# Altium schematic sheet 0_Overview.SchDoc
size A4; SheetNumber: 1; SheetTotal: 5
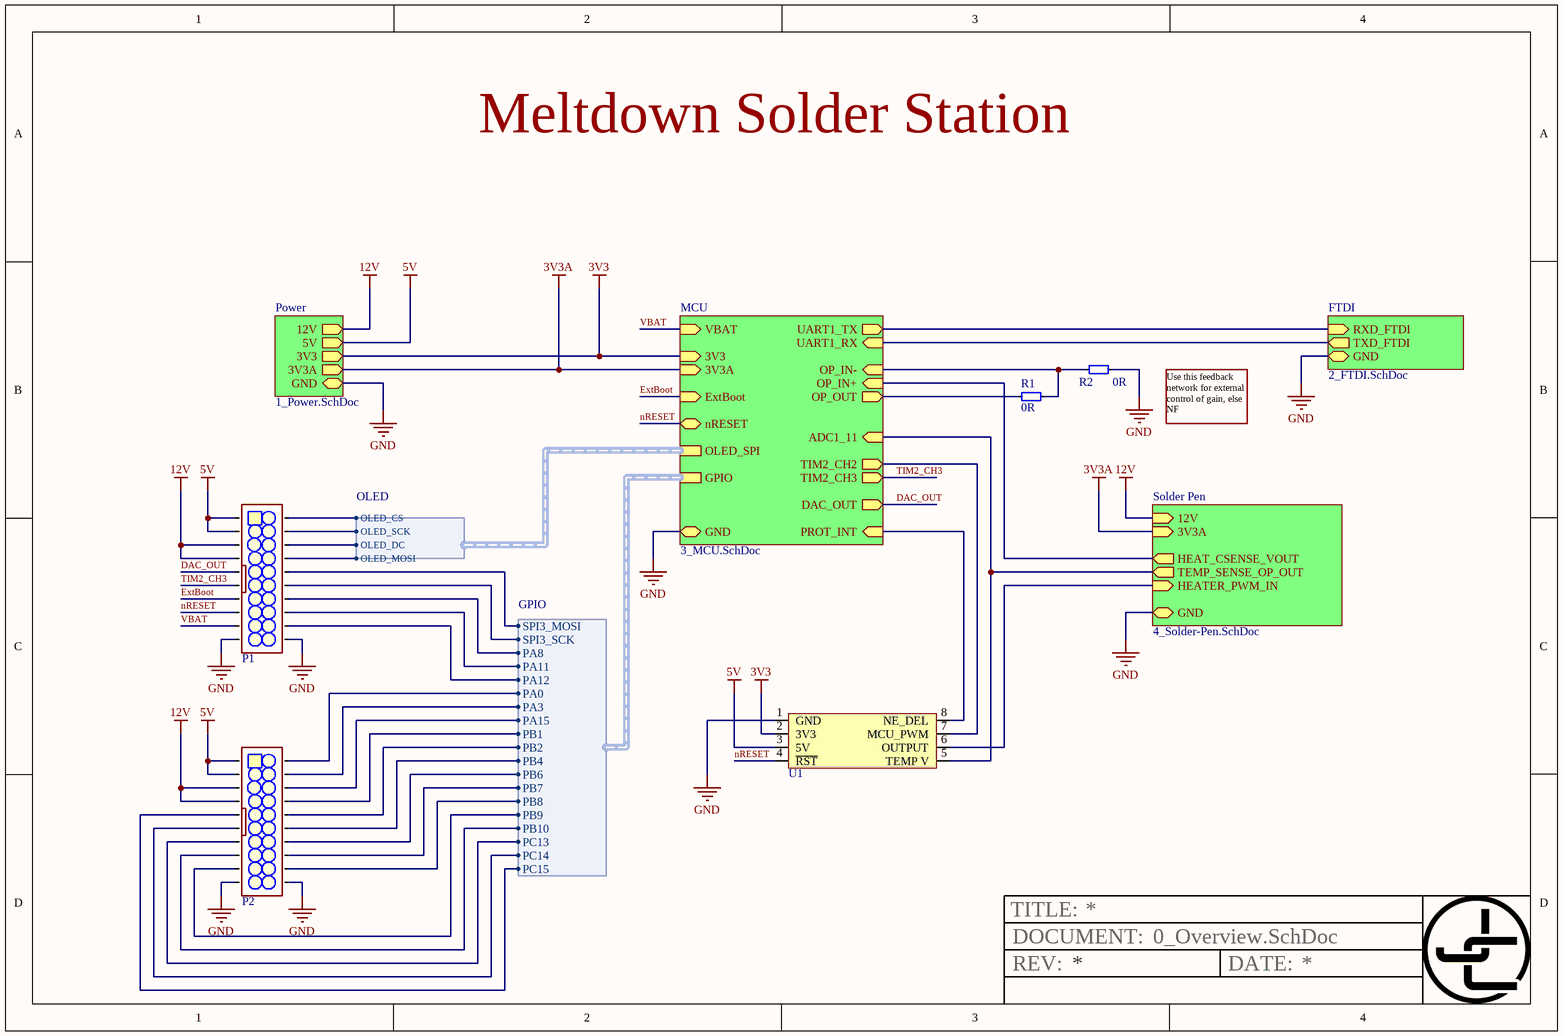
[diagram p0: 0_Overview.SchDoc]

## Parts
P1  2x10 Ribbon Header  [2x10_RIBBON_CABLE_CON]  (value not drawn)
P2  2x10 Ribbon Header  [2x10_RIBBON_CABLE_CON]  (value not drawn)
R1  value 0R  [0603]  (hidden comment: 0603, resistor)
R2  value 0R  [0603]  (hidden comment: 0603, resistor)
U1  Meltdown Protection Module  [MELTDOWN_PROT]  (value not drawn)

## Sub-sheets
FTDI = 2_FTDI.SchDoc: TXD_FTDI (out), RXD_FTDI (in), GND (bidir)
MCU = 3_MCU.SchDoc: VBAT (in), 3V3 (in), ExtBoot (in), nRESET (bidir), GND (bidir), OP_IN- (in), OP_IN+ (in), OP_OUT (out), TIM2_CH2 (out), TIM2_CH3 (out), ADC1_11 (in), UART1_TX (out), UART1_RX (in), DAC_OUT (out), OLED_SPI (harness OLED), GPIO (harness GPIO), 3V3A (in), PROT_INT (in)
Power = 1_Power.SchDoc: 3V3 (out), GND (bidir), 5V (out), 12V (out), 3V3A (out)
Solder Pen = 4_Solder-Pen.SchDoc: HEATER_PWM_IN (in), 12V (in), GND (bidir), TEMP_SENSE_OP_OUT (out), HEAT_CSENSE_VOUT (out), 3V3A (in)

## Harnesses
OLED: OLED_CS, OLED_SCK, OLED_DC, OLED_MOSI
GPIO: SPI3_MOSI, SPI3_SCK, PA8, PA11, PA12, PA0, PA3, PA15, PB1, PB2, PB4, PB6, PB7, PB8, PB9, PB10, PC13, PC14, PC15

## Nets
3V3: U1.2(3V3) ; sheet Power/3V3, sheet MCU/3V3
3V3A: sheet Power/3V3A, sheet MCU/3V3A, sheet Solder Pen/3V3A
5V: P1.1 P1.2 P2.1 P2.2 U1.3(5V) ; sheet Power/5V
12V: P1.3 P1.4 P2.3 P2.4 ; sheet Power/12V, sheet Solder Pen/12V
GND: P1.10 P1.11 P2.10 P2.11 R2.0 U1.1(GND) ; sheet Power/GND, sheet FTDI/GND, sheet MCU/GND, sheet Solder Pen/GND
DAC_OUT: P1.5 ; sheet MCU/DAC_OUT
ExtBoot: P1.7 ; sheet MCU/ExtBoot
nRESET: P1.8 U1.4(~{RST}) ; sheet MCU/nRESET
TIM2_CH3: P1.6 ; sheet MCU/TIM2_CH3
VBAT: P1.9 ; sheet MCU/VBAT
NetP1_12: P1.12 ; sheet MCU/GPIO.PA12
NetP1_13: P1.13 ; sheet MCU/GPIO.PA11
NetP1_14: P1.14 ; sheet MCU/GPIO.PA8
NetP1_15: P1.15 ; sheet MCU/GPIO.SPI3_SCK
NetP1_16: P1.16 ; sheet MCU/GPIO.SPI3_MOSI
NetP1_17: P1.17 ; sheet MCU/OLED_SPI.OLED_MOSI
NetP1_18: P1.18 ; sheet MCU/OLED_SPI.OLED_DC
NetP1_19: P1.19 ; sheet MCU/OLED_SPI.OLED_SCK
NetP1_20: P1.20 ; sheet MCU/OLED_SPI.OLED_CS
NetP2_5: P2.5 ; sheet MCU/GPIO.PC15
NetP2_6: P2.6 ; sheet MCU/GPIO.PC14
NetP2_7: P2.7 ; sheet MCU/GPIO.PC13
NetP2_8: P2.8 ; sheet MCU/GPIO.PB10
NetP2_9: P2.9 ; sheet MCU/GPIO.PB9
NetP2_12: P2.12 ; sheet MCU/GPIO.PB8
NetP2_13: P2.13 ; sheet MCU/GPIO.PB7
NetP2_14: P2.14 ; sheet MCU/GPIO.PB6
NetP2_15: P2.15 ; sheet MCU/GPIO.PB4
NetP2_16: P2.16 ; sheet MCU/GPIO.PB2
NetP2_17: P2.17 ; sheet MCU/GPIO.PB1
NetP2_18: P2.18 ; sheet MCU/GPIO.PA15
NetP2_19: P2.19 ; sheet MCU/GPIO.PA3
NetP2_20: P2.20 ; sheet MCU/GPIO.PA0
NetR1_0: R1.0 ; sheet MCU/OP_OUT
NetR1_1: R1.1 R2.1 ; sheet MCU/OP_IN-
NetU1_5: U1.5(TEMP_V) ; sheet MCU/ADC1_11, sheet Solder Pen/TEMP_SENSE_OP_OUT
NetU1_6: U1.6(OUTPUT) ; sheet Solder Pen/HEATER_PWM_IN
NetU1_7: U1.7(MCU_PWM) ; sheet MCU/TIM2_CH2
NetU1_8: U1.8(NE_DEL) ; sheet MCU/PROT_INT
(unnamed): sheet FTDI/TXD_FTDI, sheet MCU/UART1_RX
(unnamed): sheet FTDI/RXD_FTDI, sheet MCU/UART1_TX
(unnamed): sheet MCU/OP_IN+, sheet Solder Pen/HEAT_CSENSE_VOUT

## Notes on the sheet
- Meltdown Solder Station
- Use this feedback network for external control of gain, else NF
- TITLE:
- REV:
- DOCUMENT:
- DATE:

## Library data of the parts
P1 P2 = 2x10 Ribbon Header: 2.54 mm; Value: 1x10 Pin Header
U1 = Meltdown Protection Module: Protection circuit for the meltdown project